# Altium project QSTL_25P_ZIF_ZIF.PrjPcb
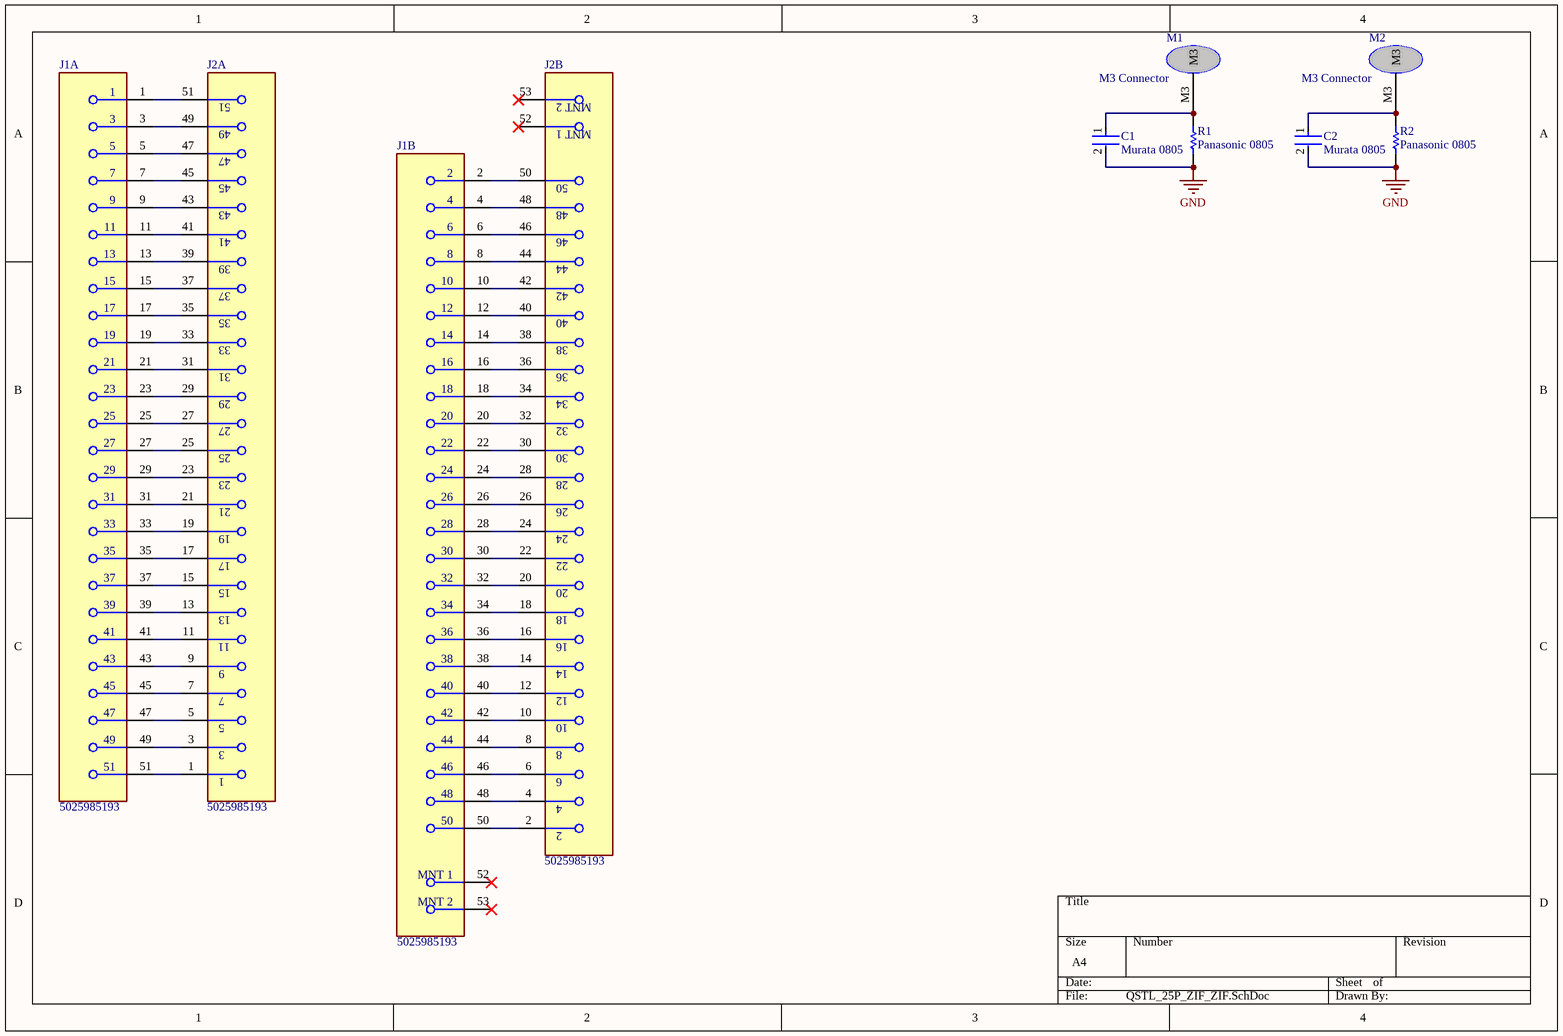
[diagram p0: QSTL_25P_ZIF_ZIF.SchDoc]
1 sheet, 8 parts. Net scope: global (net labels, ports and power ports of the same name join across sheets).
Board file: QSTL_25P_ZIF_ZIF.PcbDoc

## Sheet QSTL_25P_ZIF_ZIF.SchDoc
size A4; SheetNumber: 1; SheetTotal: 1

### Parts
C1  Murata 0805  [FP-GRM21B-0_15-MFG]
C2  Murata 0805  [FP-GRM21B-0_15-MFG]
J1  5025985193  [FP-5025985193-MFG]  (parts A,B of 2)
J2  5025985193  [FP-5025985193-MFG]  (parts A,B of 2)
M1  M3 Connector  [M3]
M2  M3 Connector  [M3]
R1  Panasonic 0805  [RESC2013X60X40LL20T25]
R2  Panasonic 0805  [RESC2013X60X40LL20T25]

### Nets
GND: C1.2 C2.2 R1.2 R2.2
NetC1_1: C1.1 M1.M3 R1.1
NetC2_1: C2.1 M2.M3 R2.1
NetJ1_1: J1.1 J2.51
NetJ1_2: J1.2 J2.50
NetJ1_3: J1.3 J2.49
NetJ1_4: J1.4 J2.48
NetJ1_5: J1.5 J2.47
NetJ1_6: J1.6 J2.46
NetJ1_7: J1.7 J2.45
NetJ1_8: J1.8 J2.44
NetJ1_9: J1.9 J2.43
NetJ1_10: J1.10 J2.42
NetJ1_11: J1.11 J2.41
NetJ1_12: J1.12 J2.40
NetJ1_13: J1.13 J2.39
NetJ1_14: J1.14 J2.38
NetJ1_15: J1.15 J2.37
NetJ1_16: J1.16 J2.36
NetJ1_17: J1.17 J2.35
NetJ1_18: J1.18 J2.34
NetJ1_19: J1.19 J2.33
NetJ1_20: J1.20 J2.32
NetJ1_21: J1.21 J2.31
NetJ1_22: J1.22 J2.30
NetJ1_23: J1.23 J2.29
NetJ1_24: J1.24 J2.28
NetJ1_25: J1.25 J2.27
NetJ1_26: J1.26 J2.26
NetJ1_27: J1.27 J2.25
NetJ1_28: J1.28 J2.24
NetJ1_29: J1.29 J2.23
NetJ1_30: J1.30 J2.22
NetJ1_31: J1.31 J2.21
NetJ1_32: J1.32 J2.20
NetJ1_33: J1.33 J2.19
NetJ1_34: J1.34 J2.18
NetJ1_35: J1.35 J2.17
NetJ1_36: J1.36 J2.16
NetJ1_37: J1.37 J2.15
NetJ1_38: J1.38 J2.14
NetJ1_39: J1.39 J2.13
NetJ1_40: J1.40 J2.12
NetJ1_41: J1.41 J2.11
NetJ1_42: J1.42 J2.10
NetJ1_43: J1.43 J2.9
NetJ1_44: J1.44 J2.8
NetJ1_45: J1.45 J2.7
NetJ1_46: J1.46 J2.6
NetJ1_47: J1.47 J2.5
NetJ1_48: J1.48 J2.4
NetJ1_49: J1.49 J2.3
NetJ1_50: J1.50 J2.2
NetJ1_51: J1.51 J2.1

Not connected (* = marked no-connect by the designer): J1 52(MNT_1)* 53(MNT_2)*; J2 52(MNT_1)* 53(MNT_2)*

### Library data of the parts
C1 C2 = CMP-2000-07555-2: Chip Multilayer Ceramic Capacitors for General Purpose, 0805, 10uF, X7R, 15%, 10%, 10V; Length: 2mm; Case Code (Metric): 2012; Height: 1.25mm; Tolerance: 10%; Width: 1.25mm; Voltage Rating: 10V; Voltage Rating (DC): 10V; Case/Package: 0805; Package Quantity: 3000; Capacitance: 10uF; REACH SVHC: No SVHC; Case Code (Imperial): 0805; Min Operating Temperature: -55°C; Termination: SMD/SMT; Depth: 1.25mm; Mount: Surface Mount; Thickness: 0.055inch; Max Operating Temperature: 125°C; Weight: 0.000335oz; Dielectric: X7R; Packaging: Tape and Reel
J1 J2 = CMP-1241-00093-2: CONN FPC 51POS 0.30MM R/A; Manufacturer: Molex; Is Female: yes; Voltage Rating: 50V; Current Rating: 0.3A; Pitch: 0.6mm; Number Of Contacts: 51; Import Ts: 1521860080; Conn Orientation: Right Angle; Ciiva Ids: 8412513; Conn Gender: Female; Device Class L2: FFC / FPC; ComponentLink2Description: Datasheet; Contact Material: Gold,Nickel; Automotive: No; Temperature Range High: +105°C; Ambient Temperature Range Low: -40°C; Height: 1.83mm; Temperature Range Low: -40°C; Package: 0; Mouser Description: FFC & FPC Connectors 0.3 FPC BackFlip Hsg RA SMT 51Ckt; Device Class L3: unset; Digikey Description: CONN FPC 51POS 0.30MM R/A; RoHS: TRUE; Temperature: -40°C to +105°C; Octopart: https://octopart.com/502598-5193-molex-33127991; ComponentLink2URL: https://www.molex.com/webdocs/datasheets/pdf/en-us/5025985193_FFC_FPC_CONNECTORS.pdf; Manufacturer Part Number: 5025985193; Release Date: 1411372322; Ambient Temperature Range High: +105°C; Category: Conn; Device Class L1: Connectors; Footprint Url: https://www.molex.com/pdm_docs/sd/5025985193_sd.pdf; Lead Free: Yes
M1 M2 = M3
R1 R2 = CMP-2001-00613-1: Part Number: ERA6AEB222V; Manufacturer: Panasonic